# Altium schematic sheet stlink.SchDoc
size A3; SheetNumber: 7; SheetTotal: 7
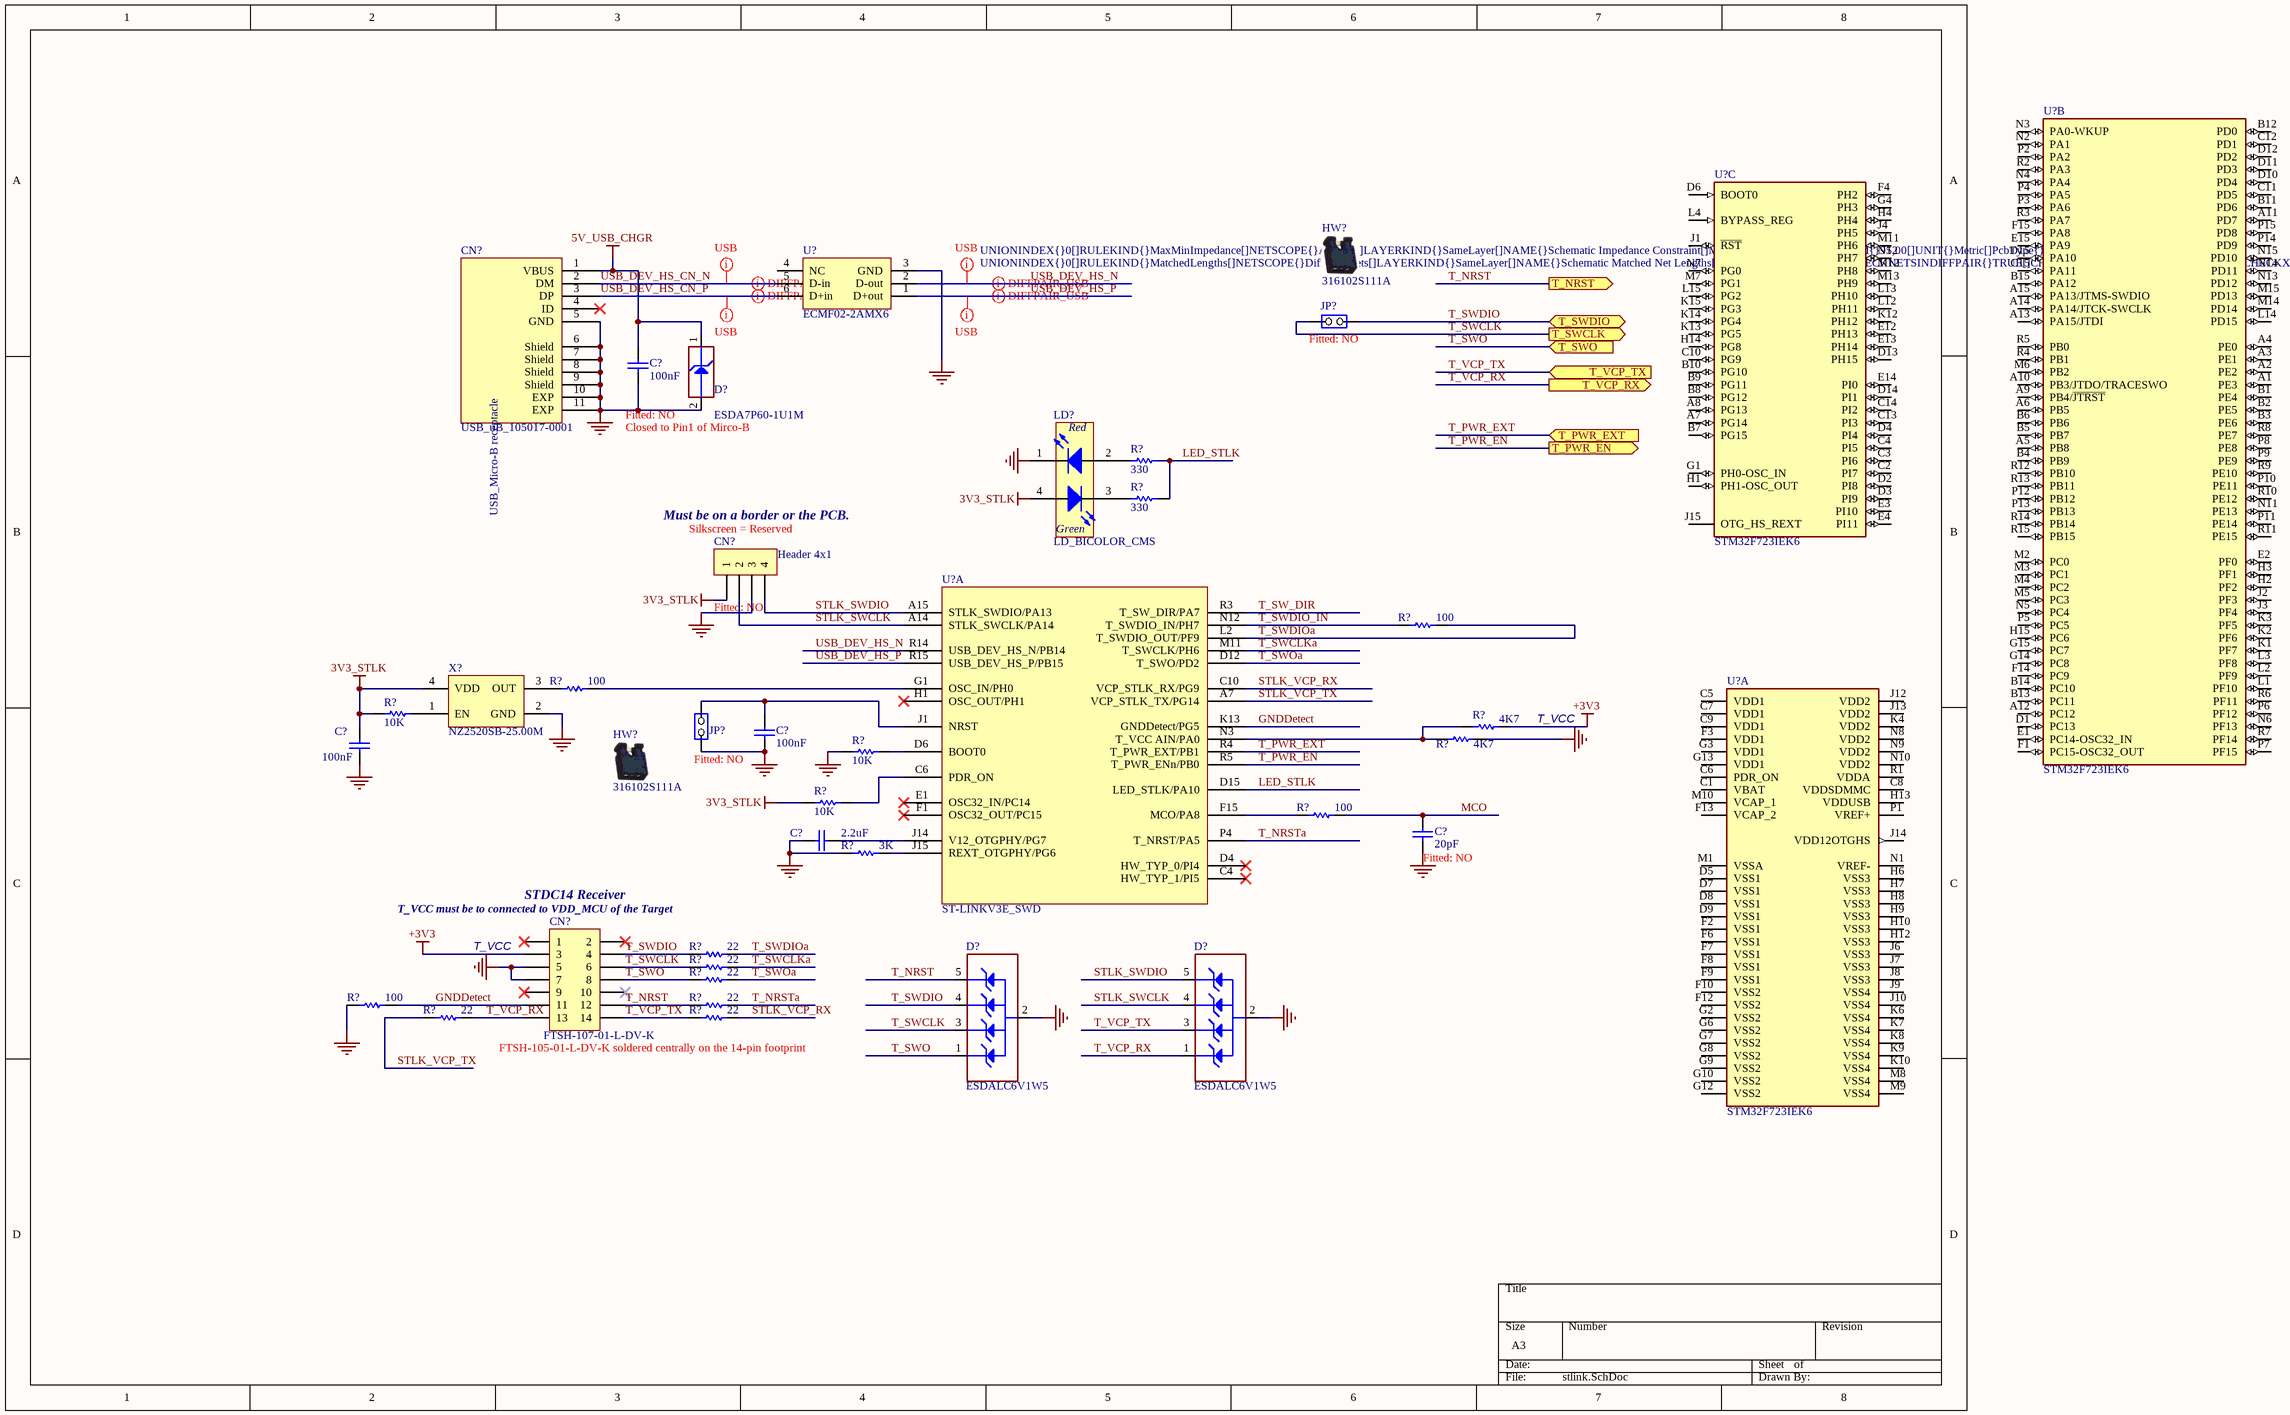
[diagram p0: stlink.SchDoc]

## Parts
(Parts that share a designator on the sheet are numbered #1, #2 ... from top to bottom, then left to right.)
C?#1  value 100nF  Fitted: NO  [0402C]  (hidden comment: [N/A])
C?#2  100nF  [0402C]
C?#3  100nF  [0402C]
C?#4  2.2uF  [0603C]
C?#5  value 20pF  Fitted: NO  [0402C]  (hidden comment: [N/A])
CN?#1  value USB_uB_105017-0001  [MICRO_USB_B_105017]  (hidden comment: USB_uB_105017.0001)
CN?#2  Fitted: NO  [HDR_1X4_2R54]  (hidden comment: Header 4x1)
CN?#3  FTSH-107-01-L-DV-K  [FTSH-107-01-L-DV_B]
D?#1  ESDA7P60-1U1M  [DO_2SM_1R6X1_21]
D?#2  ESDALC6V1W5  [SC70-5]
D?#3  ESDALC6V1W5  [SC70-5]
HW?#1  value 316102S111A  (hidden comment: JUMPER_OPEN)
HW?#2  value 316102S111A  (hidden comment: JUMPER_OPEN)
JP?#1  Fitted: NO  [SIP2]  (hidden comment: Jumper Header 2x1)
JP?#2  Fitted: NO  [SIP2]  (hidden comment: Jumper Header 2x1)
LD?  LD_BICOLOR_CMS  [LED2_3528]
R?#1  330  [0603R]
R?#2  330  [0603R]
R?#3  100  [0402R]
R?#4  100  [0402R]
R?#5  10K  [0402R]
R?#6  4K7  [0402R]
R?#7  4K7  [0402R]
R?#8  10K  [0402R]
R?#9  10K  [0402R]
R?#10  100  [0402R]
R?#11  3K  [0402R]
R?#12  22  [0603R]
R?#13  22  [0603R]
R?#14  100  [0402R]
R?#15  22  [0603R]
R?#16  22  [0603R]
R?#17  22  [0603R]
R?#18  22  [0603R]
U?#1  ECMF02-2AMX6  [DFN6_0R5_1R7X1R5]
U?#2  STM32F723IEK6  [IC_STM32F723IEK6]  (part C of 3)
U?#3  STM32F723IEK6  [IC_STM32F723IEK6]  (part B of 3)
U?#4  ST-LINKV3E_SWD  [BGA176_0R65_10x10]  (part A of 2)
U?#5  STM32F723IEK6  [IC_STM32F723IEK6]  (part A of 3)
X?  NZ2520SB-25.00M  [OSC_4SM_2R5X2]

## Ports
T_NRST (out), T_PWR_EN (out), T_PWR_EXT (in), T_SWCLK (out), T_SWDIO (bidir), T_SWO (in), T_VCP_RX (out), T_VCP_TX (in)

## Nets
3V3_STLK: C?#3.2 CN?#2.1 LD?.4(YellowGreen_anode) R?#5.1 R?#9.1 X?.4(VDD)
5V_USB_CHGR: C?#1.2 CN?#1.1(VBUS) D?#1.1(IO1)
+3V3: CN?#3.3 R?#6.2
GND: C?#1.1 C?#2.1 C?#3.1 C?#4.1 C?#5.1 CN?#1.5(GND) CN?#1.6(Shield) CN?#1.7(Shield) CN?#1.8(Shield) CN?#1.9(Shield) CN?#1.10(EXP) CN?#1.11(EXP) CN?#2.3 CN?#3.5 CN?#3.7 D?#1.2(GND) D?#2.2(GND) D?#3.2(GND) JP?#2.1(COMMON) LD?.1(RED_cathode) R?#7.2 R?#8.1 R?#11.1 R?#14.1 U?#1.3(GND) X?.2(GND)
GNDDetect: CN?#3.11 R?#14.2 U?#4.K13(GNDDetect/PG5)
LED_STLK: R?#1.2 R?#2.2 U?#4.D15(LED_STLK/PA10)
MCO: C?#5.2 R?#10.2
STLK_SWCLK: CN?#2.2 D?#3.4(IO3) U?#4.A14(STLK_SWCLK/PA14)
STLK_SWDIO: CN?#2.4 D?#3.5(IO4) U?#4.A15(STLK_SWDIO/PA13)
STLK_VCP_RX: R?#18.1 U?#4.C10(VCP_STLK_RX/PG9)
STLK_VCP_TX: R?#17.2 U?#4.A7(VCP_STLK_TX/PG14)
T_NRST: CN?#3.12 D?#2.5(IO4) R?#16.2 ; port T_NRST
T_NRSTa: R?#16.1 U?#4.P4(T_NRST/PA5)
T_PWR_EN: U?#4.R5(T_PWR_ENn/PB0) ; port T_PWR_EN
T_PWR_EXT: U?#4.R4(T_PWR_EXT/PB1) ; port T_PWR_EXT
T_SW_DIR: U?#4.R3(T_SW_DIR/PA7)
T_SWCLK: CN?#3.6 D?#2.3(IO2) JP?#1.1(COMMON) R?#13.2 ; port T_SWCLK
T_SWCLKa: R?#13.1 U?#4.M11(T_SWCLK/PH6)
T_SWDIO: CN?#3.4 D?#2.4(IO3) JP?#1.2(NO) R?#12.2 ; port T_SWDIO
T_SWDIO_IN: R?#3.1 U?#4.N12(T_SWDIO_IN/PH7)
T_SWDIOa: R?#3.2 R?#12.1 U?#4.L2(T_SWDIO_OUT/PF9)
T_SWO: CN?#3.8 D?#2.1(IO1) R?#15.2 ; port T_SWO
T_SWOa: R?#15.1 U?#4.D12(T_SWO/PD2)
T_VCP_RX: CN?#3.13 D?#3.1(IO1) R?#17.1 ; port T_VCP_RX
T_VCP_TX: CN?#3.14 D?#3.3(IO2) R?#18.2 ; port T_VCP_TX
USB_DEV_HS_CN_N: CN?#1.2(DM) U?#1.5(D-in)
USB_DEV_HS_CN_P: CN?#1.3(DP) U?#1.6(D+in)
USB_DEV_HS_N: U?#1.2(D-out) U?#4.R14(USB_DEV_HS_N/PB14)
USB_DEV_HS_P: U?#1.1(D+out) U?#4.R15(USB_DEV_HS_P/PB15)
NetC?#2_2: C?#2.2 JP?#2.2(NO) U?#4.J1(NRST)
NetC?#4_2: C?#4.2 U?#4.J14(V12_OTGPHY/PG7)
NetLD?_2: LD?.2(Red_anode) R?#1.1
NetLD?_3: LD?.3(YellowGreen_cathode) R?#2.1
NetR?#4_1: R?#4.1 X?.3(OUT)
NetR?#4_2: R?#4.2 U?#4.G1(OSC_IN/PH0)
NetR?#5_2: R?#5.2 X?.1(EN)
NetR?#6_1: R?#6.1 R?#7.1 U?#4.N3(T_VCC_AIN/PA0)
NetR?#8_2: R?#8.2 U?#4.D6(BOOT0)
NetR?#9_2: R?#9.2 U?#4.C6(PDR_ON)
NetR?#10_1: R?#10.1 U?#4.F15(MCO/PA8)
NetR?#11_2: R?#11.2 U?#4.J15(REXT_OTGPHY/PG6)

Not connected (* = marked no-connect by the designer): CN?#1 4(ID)*; CN?#3 1* 2* 9* 10*; U?#1 4(NC); U?#2 A7(PG14) A8(PG13) B7(PG15) B8(PG12) B9(PG11) B10(PG10) C2(PI7) C3(PI6) C4(PI5) C10(PG9) C13(PI3) C14(PI2) D2(PI8) D3(PI9) D4(PI4) D6(BOOT0) D13(PH15) D14(PI1) E3(PI10) E4(PI11) E12(PH13) E13(PH14) E14(PI0) F4(PH2) G1(PH0-OSC_IN) G4(PH3) H1(PH1-OSC_OUT) H4(PH4) H14(PG8) J1(~{RST}) J4(PH5) J15(OTG_HS_REXT) K12(PH12) K13(PG5) K14(PG4) K15(PG3) L4(BYPASS_REG) L12(PH11) L13(PH10) L15(PG2) M7(PG1) M11(PH6) M12(PH8) M13(PH9) N7(PG0) N12(PH7); U?#3 A1(PE3) A2(PE2) A3(PE1) A4(PE0) A5(PB8) A6(PB5) A9(PB4/~{JTRST}) A10(PB3/JTDO/TRACESWO) A11(PD7) A12(PC12) A13(PA15/JTDI) A14(PA14/JTCK-SWCLK) A15(PA13/JTMS-SWDIO) B1(PE4) B2(PE5) B3(PE6) B4(PB9) B5(PB7) B6(PB6) B11(PD6) B12(PD0) B13(PC11) B14(PC10) B15(PA12) C11(PD5) C12(PD1) C15(PA11) D1(PC13) D10(PD4) D11(PD3) D12(PD2) D15(PA10) E1(PC14-OSC32_IN) E2(PF0) E15(PA9) F1(PC15-OSC32_OUT) F14(PC9) F15(PA8) G14(PC8) G15(PC7) H2(PF2) H3(PF1) H15(PC6) J2(PF3) J3(PF4) K1(PF7) K2(PF6) K3(PF5) L1(PF10) L2(PF9) L3(PF8) L14(PD15) M2(PC0) M3(PC1) M4(PC2) M5(PC3) M6(PB2) M14(PD14) M15(PD13) N2(PA1) N3(PA0-WKUP) N4(PA4) N5(PC4) N6(PF13) N11(PE13) N13(PD12) N14(PD11) N15(PD10) P2(PA2) P3(PA6) P4(PA5) P5(PC5) P6(PF12) P7(PF15) P8(PE8) P9(PE9) P10(PE11) P11(PE14) P12(PB12) P13(PB13) P14(PD9) P15(PD8) R2(PA3) R3(PA7) R4(PB1) R5(PB0) R6(PF11) R7(PF14) R8(PE7) R9(PE10) R10(PE12) R11(PE15) R12(PB10) R13(PB11) R14(PB14) R15(PB15); U?#4 C4(HW_TYP_1/PI5)* D4(HW_TYP_0/PI4)* E1(OSC32_IN/PC14)* F1(OSC32_OUT/PC15)* H1(OSC_OUT/PH1)*; U?#5 C1(VBAT) C5(VDD1) C6(PDR_ON) C7(VDD1) C8(VDDSDMMC) C9(VDD1) D5(VSS1) D7(VSS1) D8(VSS1) D9(VSS1) F2(VSS1) F3(VDD1) F6(VSS1) F7(VSS1) F8(VSS1) F9(VSS1) F10(VSS2) F12(VSS2) F13(VCAP_2) G2(VSS2) G3(VDD1) G6(VSS2) G7(VSS2) G8(VSS2) G9(VSS2) G10(VSS2) G12(VSS2) G13(VDD1) H6(VSS3) H7(VSS3) H8(VSS3) H9(VSS3) H10(VSS3) H12(VSS3) H13(VDDUSB) J6(VSS3) J7(VSS3) J8(VSS3) J9(VSS4) J10(VSS4) J12(VDD2) J13(VDD2) J14(VDD12OTGHS) K4(VDD2) K6(VSS4) K7(VSS4) K8(VSS4) K9(VSS4) K10(VSS4) M1(VSSA) M8(VSS4) M9(VSS4) M10(VCAP_1) N1(VREF-) N8(VDD2) N9(VDD2) N10(VDD2) P1(VREF+) R1(VDDA)

## Layout directives
differential pair; rule Impedance Constraint [Min = 85.00    Max = 95.00    ]: USB_DEV_HS_CN_N, USB_DEV_HS_CN_P, USB_DEV_HS_N, USB_DEV_HS_P
rule Undefined; rule Matched Net Lengths [Tolerance = 0.2mm]; rule Impedance Constraint [Min = 85.00    Max = 95.00    ]: USB_DEV_HS_CN_N, USB_DEV_HS_CN_P, USB_DEV_HS_N, USB_DEV_HS_P

## Notes on the sheet
- (near D?#1) Closed to Pin1 of Mirco-B
- Must be on a border or the PCB.
- (near CN?#2) Silkscreen = Reserved
- (near R?#6) T_VCC
- T_VCC must be to connected to VDD_MCU of the Target
- (near CN?#3) STDC14 Receiver
- T_VCC
- FTSH-105-01-L-DV-K soldered centrally on the 14-pin footprint
- (in symbol MCD-00028) USB_Micro-B receptacle
- (in symbol MCD-00051) Red; Green

## Library data of the parts
C?#1 C?#5 = MCD-00016: Capacitor,20pF,50V,NPO,5%,0402; Manufacturer_Part_Number: CC0402JRNPO9BN200; Manufacturer: YAGEO; Provided_By: Subcon; Initial_Board_Reference: mb1274; Internal_Part_Number: MCD-00016; Status: Released; Package: 0402; ComponentLink1Description: Yageo_Capacitor_NP0_16V-to-50V.pdf; ECCN_US: n/a; ECCN_EU: n/a; Part_Type: Capacitor
C?#2 C?#3 = MCD-00102: Capacitor,100nF,16V,X7R,10%,0402; Manufacturer_Part_Number: CC0402KRX7R7BB104; Manufacturer: YAGEO; Provided_By: Subcon; Initial_Board_Reference: mb1262; Internal_Part_Number: MCD-00102; Value: 100nF; Status: Released; Package: 0402; ComponentLink1Description: Capacitor_X7R_100pF_to_22uF.pdf; ECCN_US: n/a; ECCN_EU: n/a; Part_Type: Capacitor
C?#4 = MCD-00012: Capacitor,2.2uF,10V, X5R,10%,0603; Manufacturer_Part_Number: CC0603KRX5R6BB225; Manufacturer: YAGEO; Alternate_Manufacturer_Part_Number: C0603C225K8PACTU; Alternate_Manufacturer: KEMET; Provided_By: Subcon; Initial_Board_Reference: mb1274; Internal_Part_Number: MCD-00012; Value: 2.2uF; Status: Released; Package: 0603; ComponentLink1Description: Yageo_Capacitor_X5R-series.pdf; ECCN_US: n/a; ECCN_EU: n/a; Part_Type: Capacitor
CN?#1 = MCD-00028: USB-MICRO-B, 0.65mm, RA, SMT, Bottom Mount,; Manufacturer_Part_Number: 1050170001; Manufacturer: MOLEX; Part_Type: Connector; Provided_By: Subcon; Initial_Board_Reference: mb1274; Internal_Part_Number: MCD-00028; Status: Released; ComponentLink1Description: Molex_Connector-USB-uB_1050170001.pdf; ECCN_US: n/a; ECCN_EU: n/a
CN?#2 = MCD-00029: Header, 4x1, 2,54mm, VR, TH, Height 5.84mm/2.54mm; Manufacturer_Part_Number: TSW-104-07-G-S; Manufacturer: SAMTEC; Part_Type: Connector; Provided_By: Subcon; Initial_Board_Reference: mb1274; Internal_Part_Number: MCD-00029; Value: Header 4x1; Status: Released; ComponentLink1Description: Samtec_Connector_TSW-HTSW-series.pdf; ECCN_US: n/a; ECCN_EU: n/a
CN?#3 = MCD-00592: Header 7x2, 1.27mm, Dual row, Straight; Manufacturer_Part_Number: FTSH-107-01-L-DV-009-ES-A; Manufacturer: SAMTEC; Part_Type: Connector; Provided_By: Subcon; Initial_Board_Reference: mb1331; Internal_Part_Number: MCD-00592; Value: FTSH-107-01-L-DV-K; Status: Symbol available; ComponentLink1Description: Samtec_ftsh_smt.pdf; ComponentLink1URL: http://tunmcdsvn.tun.st.com/Component_Datasheet_Library/Trunk/Connectors/Samtec_ftsh_smt.pdf
D?#1 = ESDALC6V1-1U2: Dual Transil array for ESD protection; Manuf_1: STM; Ref St: .; ECCN_US/EU: EAR99/NEC; Fitted: NO; Provided: ST; Manuf_Part_1: ESDA7P60-1U1M; Distrib: ST; Ordered by: STM; Order: ESDA7P60-1U1M
D?#2 D?#3 = ESDALC6V1W5: Dual Transil array for ESD protection; Manuf_1: STM; Ref St: 9179034; Fitted: YES; ECCN_US/EU: EAR99/NEC; Manuf_Part_1: ESDALC6V1W5; Distrib: ST; Order: ESDALC6V1W5; Ordered by: STM
HW?#1 HW?#2 = MCD-01849: Jumper, 2.54mm, Black, 3A, 6mm, 20mR; Part_Type: Misc; Part_Preference: Alternate; Manufacturer: JIUBABA; Partial_Alternate_Internal_Part_Number: MCD-00122, MCD-00043; Component_Country_Of_Origin: Unknown; Alternate_EMS: A; ShowFields: YES; ID: 3949; Internal_Part_Number: MCD-01849; Status: Released; Manufacturer_Part_Number: 316102S111A; Package: 2.4x5mm; ComponentLink1URL: http://tunmcdsvn.tun.st.com/Component_Documentation_Library/Trunk/Misc/JIUBABA_316102S111A; Order_Code_Digikey: N/A; Order_Code_Farnell: N/A; Order_Code_RS: N/A
JP?#1 = MCD-00045: Header, 2x1, 2,54mm, VR, TH, Height 5.84mm/2.54mm; Manufacturer_Part_Number: TSW-102-07-x-S; Manufacturer: SAMTEC; Part_Type: Connector; Value: Jumper_Header_2x1; Provided_By: Subcon; Initial_Board_Reference: mb1274; Internal_Part_Number: MCD-00045; Status: Released; ComponentLink1Description: Samtec_Connector_TSW-HTSW-series.pdf; ECCN_US: n/a; ECCN_EU: n/a
JP?#2 = MCD-00045: Header, 2x1, 2,54mm, VR, TH, Height 5.84mm/2.54mm; Manufacturer_Part_Number: TSW-102-07-G-S; Manufacturer: SAMTEC; Part_Type: Connector; Value: Jumper_Header_2x1; Provided_By: Subcon; Initial_Board_Reference: mb1274; Internal_Part_Number: MCD-00045; Status: Released; ComponentLink1Description: Samtec_Connector_TSW-HTSW-series.pdf; ECCN_US: n/a; ECCN_EU: n/a
LD? = MCD-00051: LED Bicolor; Part_Type: Display; Manufacturer_Part_Number: HSMF-A201-A00J1; Manufacturer: AVAGO TECHNOLOGIES; Alternate_Manufacturer_Part_Number: LE-RGW35280; Alternate_Manufacturer: EVERLUCK; ECCN_US: EAR99; ECCN_EU: NEC; Provided_By: Subcon; Initial_Board_Reference: mb1274; Internal_Part_Number: MCD-00051; Value: LD_BICOLOR_CMS; Status: Released; ComponentLink1Description: Avago_LED-SMC_HSMx-A2xx-02Feb2012.pdf
R?#1 R?#2 = MCD-00197: Resistor,330R,0603,1%,1/10W; Manufacturer_Part_Number: RC0603FR-07330RL; Manufacturer: YAGEO; Provided_By: Subcon; Internal_Part_Number: MCD-00197; Value: 330; Status: Released; ComponentLink1Description: Yageo_Resistor_RC0603-series.pdf; ECCN_US: n/a; ECCN_EU: n/a; Part_Type: Resistor
R?#3 R?#4 R?#10 R?#14 = MCD-00119: Resistor,100R,0402,1%,1/16W; Manufacturer_Part_Number: RC0402FR-07100RL; Manufacturer: YAGEO; Provided_By: Subcon; Initial_Board_Reference: mb1262; Internal_Part_Number: MCD-00119; Value: 100; Status: Released; Part_Type: Resistor; ComponentLink1Description: Yageo_Resistor_RC0402-series.pdf; ECCN_US: n/a; ECCN_EU: n/a
R?#5 R?#8 R?#9 = MCD-00053: Resistor,10K,0402,1%,1/16W; Manufacturer_Part_Number: RC0402FR-0710KL; Manufacturer: YAGEO; Provided_By: subcon; Initial_Board_Reference: mb1274; Internal_Part_Number: MCD-00053; Value: 10K; Status: Released; ComponentLink1Description: Yageo_Resistor_RC0402-series.pdf; ECCN_US: n/a; ECCN_EU: n/a; Part_Type: Resistor
R?#6 R?#7 = MCD-00065: Resistor,4K7,0402,1%,1/16W; Manufacturer_Part_Number: RC0402FR-074K7L; Manufacturer: YAGEO; Alternate_Manufacturer_Part_Number: RT0402FRE074K7L; Provided_By: Subcon; Initial_Board_Reference: mb1274; Internal_Part_Number: MCD-00065; Value: 4K7; Status: Released; ComponentLink1Description: Yageo_Resistor_RC0402-series.pdf; ECCN_US: n/a; ECCN_EU: n/a; Alternate_Manufacturer: YAGEO; Part_Type: Resistor
R?#11 = MCD-00185: Resistor,3K,0402,1%,1/16W; Manufacturer_Part_Number: RC0402FR-073KL; Manufacturer: YAGEO; Provided_By: Subcon; Internal_Part_Number: MCD-00185; Value: 3K; Status: Released; ComponentLink1Description: Yageo_Resistor_RC0402-series.pdf; ECCN_US: n/a; ECCN_EU: n/a; Part_Type: Resistor
R?#12 R?#13 R?#15-R?#18 = Res1: Resistor; Value: 1K; Published: 8-Jun-2000; Revision: July-2002: Re-released for DXP Platform.; Publisher: Altium Limited
U?#1 = ECMF02-2AMX6: Common mode filter with ESD protection for USB 2.0 interface; Manuf_1: STM; ECCN_US/EU: EAR99/NEC; Fitted: YES; Manuf_Part_1: ECMF02-2AMX6; Ordered by: STM; Value: ECMF02-2AMX6
U?#2 U?#3 U?#5 = STM32F723IEK6: ARMÂ® CortexÂ®-M7 STM32F7 Microcontroller IC 32-Bit Single-Core 216MHz 512KB (512K x 8) FLASH 176-UFBGA (10x10); MF: STMicroelectronics; SnapEDA_Link: https://www.snapeda.com/parts/STM32F723IEK6/STMicroelectronics/view-part/?ref=snap; Package: UFBGA-176 STMicroelectronics; Value: *; MP: STM32F723IEK6; Check_prices: https://www.snapeda.com/parts/STM32F723IEK6/STMicroelectronics/view-part/?ref=eda
U?#4 = ST-LINKV3E_SWD: STM32F723IEK  (STM32F7 LittleBirdie) BGA176; Internal_Part_Number: MCD-00596; Manuf_Part_1: STM32F723IEK6; Manuf_1: STM; Initial_Board_Reference: mb1331; Fitted: YES; ECCN_US/EU: 3A991A2/NEC; Value: ST-LINKV3E_SWD; ComponentLink1Description: BGA176+25L_10x10x0.6_pitch0.65.pdf; ComponentLink1URL: http://tunmcdsvn.tun.st.com/Component_Datasheet_Library/Trunk/IC/BGA176+25L_10x10x0.6_pitch0.65.pdf; Ordered by: STM
X? = OSC_25M_NZ2520SB: Oscillator 25.00Mhz, -+50PPM, 3.3V, Temp -55 to +125癈; Manuf_Part_1: NZ2520SB 25MHz END4869B; Manuf_1: NDK; Manuf_Part_2: KC2520B25.0000C10E00; Manuf_2: AVX Corp/Kyocera Corp; Ordered by: STM; ECCN_US/EU: EAR99/NEC; Ref St: 9157031; Fitted: YES